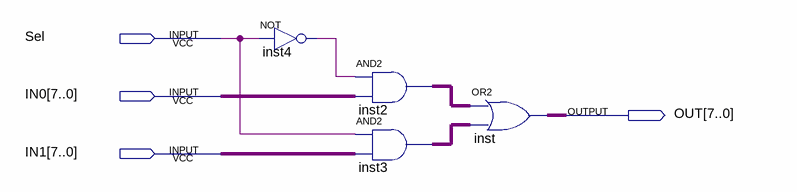
[diagram p0: schematic sheet]
// Quartus schematic MUX21.bdf as structural Verilog: 4 symbols, 4 pins
module MUX21 (
  input  Sel,
  input  [7:0] IN0,
  input  [7:0] IN1,
  output [7:0] OUT
);

  wire inst4_out;
  wire [7:0] inst2_out, inst3_out;

  not inst4 (inst4_out, Sel);
  assign inst2_out = {8{inst4_out}} & IN0;  // AND2 inst2, 8 bits wide
  assign inst3_out = {8{Sel}} & IN1;  // AND2 inst3, 8 bits wide
  assign OUT = inst2_out | inst3_out;  // OR2 inst, 8 bits wide
endmodule
